# Altium schematic sheet [02]-Thermistors.SchDoc: ENTER SHEET TITLE
size B; Engineer: ENTER ENGINEER NAME; Organization: CUAir; Address1: L3, 12a Rodborough Rd; Address2: Frenchs Forest; Address3: NSW; Address4: Australia 2086; Revision: ENTER REVISION NUMBER; CompetitionYear: 2019; CPN: ENTER CPN; PROJECT: ENTER PROJECT NAME
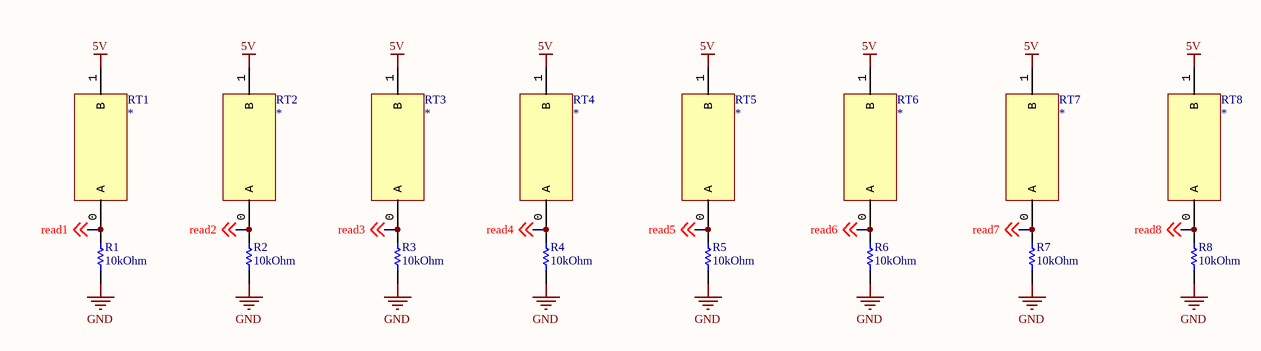
[diagram p0: [02]-Thermistors.SchDoc]

## Parts
R1  10kOhm  [RESC2013X60X35LL10T20]
R2  10kOhm  [RESC2013X60X35LL10T20]
R3  10kOhm  [RESC2013X60X35LL10T20]
R4  10kOhm  [RESC2013X60X35LL10T20]
R5  10kOhm  [RESC2013X60X35LL10T20]
R6  10kOhm  [RESC2013X60X35LL10T20]
R7  10kOhm  [RESC2013X60X35LL10T20]
R8  10kOhm  [RESC2013X60X35LL10T20]
RT1  *  [thermistor]
RT2  *  [thermistor]
RT3  *  [thermistor]
RT4  *  [thermistor]
RT5  *  [thermistor]
RT6  *  [thermistor]
RT7  *  [thermistor]
RT8  *  [thermistor]

## Nets
5V: RT1.1(B) RT2.1(B) RT3.1(B) RT4.1(B) RT5.1(B) RT6.1(B) RT7.1(B) RT8.1(B)
GND: R1.1 R2.1 R3.1 R4.1 R5.1 R6.1 R7.1 R8.1
read1: R1.2 RT1.0(A) ; off-sheet read1
read2: R2.2 RT2.0(A) ; off-sheet read2
read3: R3.2 RT3.0(A) ; off-sheet read3
read4: R4.2 RT4.0(A) ; off-sheet read4
read5: R5.2 RT5.0(A) ; off-sheet read5
read6: R6.2 RT6.0(A) ; off-sheet read6
read7: R7.2 RT7.0(A) ; off-sheet read7
read8: R8.2 RT8.0(A) ; off-sheet read8

## Notes on the sheet
- Project
- Title
- Size:
- Date:
- B
- Number:
- Revision:
- File:

## Library data of the parts
R1-R8 = CMP-1659-00013-2: RES 10.0K OHM 1/8W 1% 0805 SMD; MPN: RC0805FR-0710KL; Manufacturer: Yageo; PackageReference: 0805; ComponentLink1URL: http://www.yageo.com/documents/recent/PYu-RC_Group_51_RoHS_L_04.pdf; ComponentLink1Description: Datasheet; Value: 10kOhm
RT1-RT8 = thermistor: MPN: *; Manufacturer: *; Value: *